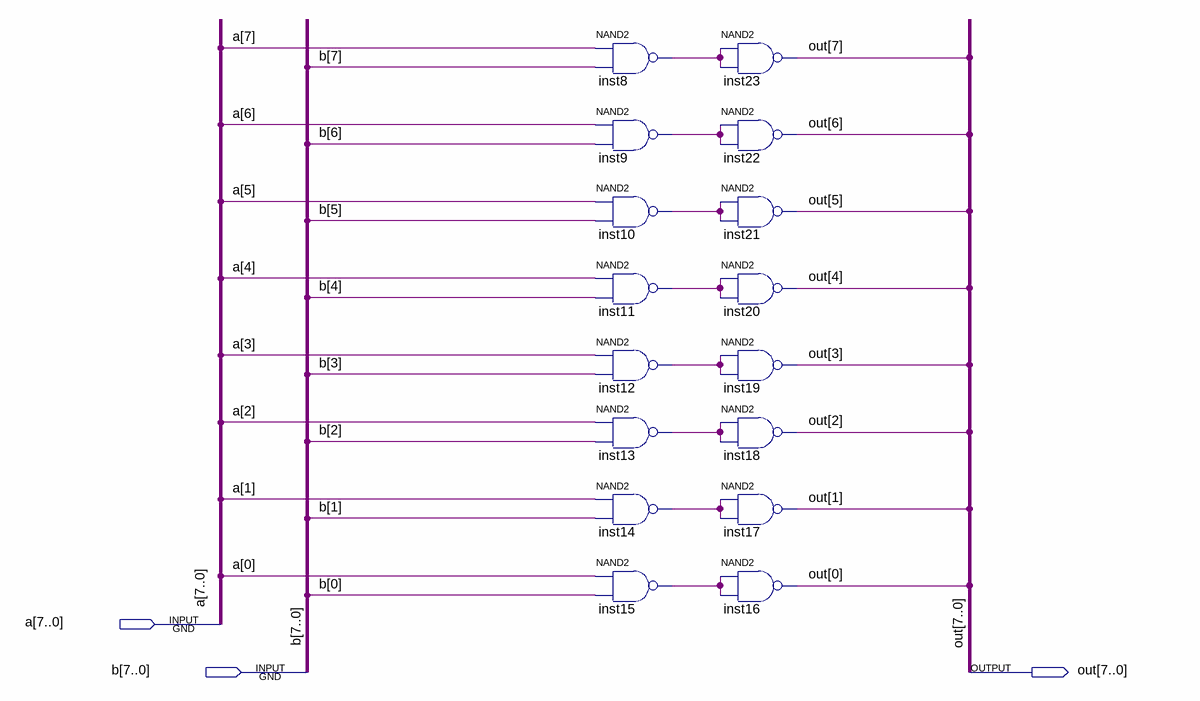
[diagram p0: schematic sheet]
// Quartus schematic And8Bit.bdf as structural Verilog: 16 symbols, 3 pins
module And8Bit (
  input  [7:0] a,
  input  [7:0] b,
  output [7:0] out
);

  wire inst8_out, inst9_out, inst10_out, inst11_out, inst12_out, inst13_out, inst14_out, inst15_out;

  nand inst8 (inst8_out, a[7], b[7]);
  nand inst9 (inst9_out, a[6], b[6]);
  nand inst10 (inst10_out, a[5], b[5]);
  nand inst11 (inst11_out, a[4], b[4]);
  nand inst12 (inst12_out, a[3], b[3]);
  nand inst13 (inst13_out, a[2], b[2]);
  nand inst14 (inst14_out, a[1], b[1]);
  nand inst15 (inst15_out, a[0], b[0]);
  nand inst23 (out[7], inst8_out, inst8_out);
  nand inst22 (out[6], inst9_out, inst9_out);
  nand inst21 (out[5], inst10_out, inst10_out);
  nand inst20 (out[4], inst11_out, inst11_out);
  nand inst19 (out[3], inst12_out, inst12_out);
  nand inst18 (out[2], inst13_out, inst13_out);
  nand inst17 (out[1], inst14_out, inst14_out);
  nand inst16 (out[0], inst15_out, inst15_out);
endmodule
